# EAGLE design TinyBot (EAGLE 9.2.2)
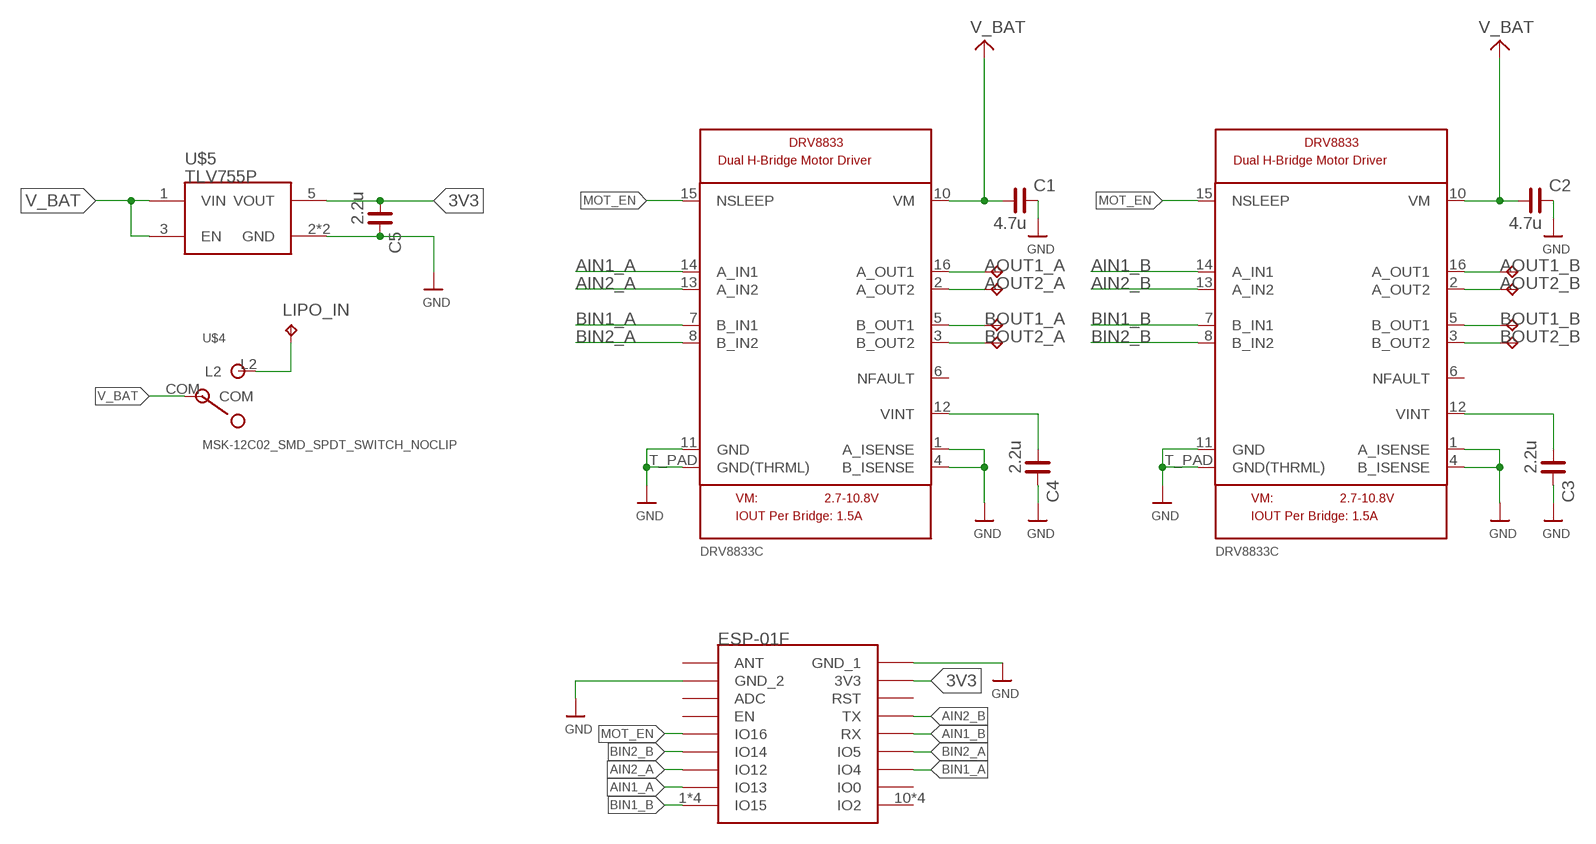
[diagram p0: schematic, sheet 1]

## Parts
C1  4.7u  C_0201  [C0201]
C2  4.7u  C_0201  [C0201]
C3  2.2u  C_0201  [C0201]
C4  2.2u  C_0201  [C0201]
C5  2.2u  C_0201  [C0201]
LIPO_IN  TPTP11SQ  [TP11SQ]
TP1  TPTP07SQ  [TP07SQ]
TP2  TPTP07SQ  [TP07SQ]
TP3  TPTP07SQ  [TP07SQ]
TP4  TPTP07SQ  [TP07SQ]
TP5  TPTP07SQ  [TP07SQ]
TP6  TPTP07SQ  [TP07SQ]
TP7  TPTP07SQ  [TP07SQ]
TP8  TPTP07SQ  [TP07SQ]
U$1  ESP01F  [ESP01F]
U$4  MSK-12C02_SMD_SPDT_SWITCH_NOCLIP  [MSK-12C02_NOCLIP]
U$5  TLV755P  [SOT23-5]
U$11  DRV8833C  [QFN16]
U$16  DRV8833C  [QFN16]

## Nets
3V3: C5.1 U$1.17(3V3) U$1.26(3V3) U$1.44(3V3) U$1.71(3V3) U$5.5(VOUT)
AIN1_A: U$1.2(IO13) U$1.29(IO13) U$1.47(IO13) U$1.56(IO13) U$11.14(A_IN1)
AIN1_B: U$1.14(RX) U$1.23(RX) U$1.41(RX) U$1.68(RX) U$16.14(A_IN1)
AIN2_A: U$1.3(IO12) U$1.30(IO12) U$1.48(IO12) U$1.57(IO12) U$11.13(A_IN2)
AIN2_B: U$1.15(TX) U$1.24(TX) U$1.42(TX) U$1.69(TX) U$16.13(A_IN2)
AOUT1_A: TP1.TP U$11.16(A_OUT1)
AOUT1_B: TP5.TP U$16.16(A_OUT1)
AOUT2_A: TP2.TP U$11.2(A_OUT2)
AOUT2_B: TP6.TP U$16.2(A_OUT2)
BIN1_A: U$1.12(IO4) U$1.21(IO4) U$1.39(IO4) U$1.66(IO4) U$11.7(B_IN1)
BIN1_B: U$1.1(IO15) U$1.28(IO15) U$1.46(IO15) U$1.55(IO15) U$16.7(B_IN1)
BIN2_A: U$1.13(IO5) U$1.22(IO5) U$1.40(IO5) U$1.67(IO5) U$11.8(B_IN2)
BIN2_B: U$1.4(IO14) U$1.31(IO14) U$1.49(IO14) U$1.58(IO14) U$16.8(B_IN2)
BOUT1_A: TP3.TP U$11.5(B_OUT1)
BOUT1_B: TP7.TP U$16.5(B_OUT1)
BOUT2_A: TP4.TP U$11.3(B_OUT2)
BOUT2_B: TP8.TP U$16.3(B_OUT2)
GND: C1.2 C2.2 C3.2 C4.2 C5.2 U$1.8(GND_2) U$1.18(GND_1) U$1.27(GND_1) U$1.35(GND_2) U$1.45(GND_1) U$1.53(GND_2) U$1.62(GND_2) U$1.72(GND_1) U$5.2(GND) U$5.4(GND) U$11.1(A_ISENSE) U$11.4(B_ISENSE) U$11.11(GND) U$11.T_PAD(GND(THRML)) U$16.1(A_ISENSE) U$16.4(B_ISENSE) U$16.11(GND) U$16.T_PAD(GND(THRML))
LIPO_IN: LIPO_IN.TP U$4.L2
MOT_EN: U$1.5(IO16) U$1.32(IO16) U$1.50(IO16) U$1.59(IO16) U$11.15(NSLEEP) U$16.15(NSLEEP)
V_BAT: C1.1 C2.1 U$4.COM U$5.1(VIN) U$5.3(EN) U$11.10(VM) U$16.10(VM) ; supply symbol labelled VMOTOR
VINT_A: C4.1 U$11.12(VINT)
VINT_B: C3.1 U$16.12(VINT)
Unconnected: U$1.6(EN) U$1.7(ADC) U$1.9(ANT) U$1.10(IO2) U$1.11(IO0) U$1.16(RST) U$1.19(IO2) U$1.20(IO0) U$1.25(RST) U$1.33(EN) U$1.34(ADC) U$1.36(ANT) U$1.37(IO2) U$1.38(IO0) U$1.43(RST) U$1.51(EN) U$1.52(ADC) U$1.54(ANT) U$1.60(EN) U$1.61(ADC) U$1.63(ANT) U$1.64(IO2) U$1.65(IO0) U$1.70(RST) U$11.6(NFAULT) U$16.6(NFAULT)

## Notes on the sheet
- V_BAT | V_BAT

## Library data of the parts
C1-C5 = rc-master-smd:C_: NON-POLARIZED CAP
LIPO_IN TP1-TP8 = testpad:TP: Test pad
U$1 = esp8266modules:ESP01F: ESP01F Module Based on the ESP8285. No Thermal Pad.
U$4 = MSK-12C02 Switch SPDT:MSK-12C02_SMD_SPDT_SWITCH_NOCLIP
U$5 = SparkFun-IC-Power:TLV755P
U$11 U$16 = qfn16:DRV8833C

## Board
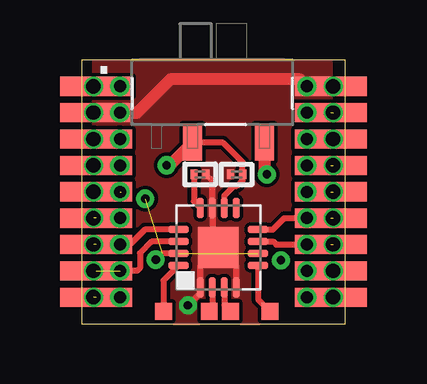
[diagram p1: board, top side]
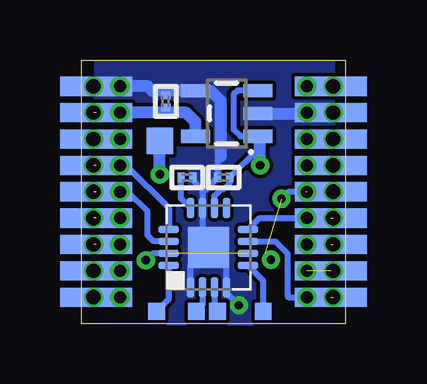
[diagram p2: board, bottom side, seen from below]

Size 11 x 11 mm. Coordinates in mm from the lower left corner, seen from the top.
Outline: 0,0 11,0 11,11 0,11 0,0
Copper layers (1*16): Top 0.035mm / dielectric 1.5mm / Bottom 0.035mm
Design rules "default *": minimum track width 6mil, minimum drill 0.35mm, track to track 6mil, track to pad 6mil, pad to pad 6mil, via to via 6mil, smd to smd 6mil, copper to edge 0mil, drill to drill 6mil, minimum pad ring 0mil, minimum via ring 8mil, stop-mask expansion 4mil, vias tented up to drill 0mil, thermal gap 10mil

### Footprints (pad centres in the part's own frame; a part is rotated, then mirrored left to right if it is on the bottom)
C0201 = smd 0.3 x 0.4: 1 -0.254,0; 2 0.254,0
TP11SQ = smd 1.1 x 1.1: TP 0,0
TP07SQ = smd 0.7 x 0.7: TP 0,0
ESP01F = smd 3 x 0.8: 1 0.1,1.1; 2 0.1,2.2; 3 0.1,3.3; 4 0.1,4.4; 5 0.1,5.5; 6 0.1,6.6; 7 0.1,7.7; 8 0.1,8.8; 9 0.1,9.9; 10 9.9,1.1; 11 9.9,2.2; 12 9.9,3.3; 13 9.9,4.4; 14 9.9,5.5; 15 9.9,6.6; 16 9.9,7.7; 17 9.9,8.8; 18 9.9,9.9 | smd 3 x 0.8 bottom: 19 9.9,1.1; 20 9.9,2.2; 21 9.9,3.3; 22 9.9,4.4; 23 9.9,5.5; 24 9.9,6.6; 25 9.9,7.7; 26 9.9,8.8; 27 9.9,9.9; 28 0.1,1.1; 29 0.1,2.2; 30 0.1,3.3; 31 0.1,4.4; 32 0.1,5.5; 33 0.1,6.6; 34 0.1,7.7; 35 0.1,8.8; 36 0.1,9.9 | drill 0.6 pad 0.8: 37 10,1.1; 38 10,2.2; 39 10,3.3; 40 10,4.4; 41 10,5.5; 42 10,6.6; 43 10,7.7; 44 10,8.8; 45 10,9.9; 46 0,1.1; 47 0,2.2; 48 0,3.3; 49 0,4.4; 50 0,5.5; 51 0,6.6; 52 0,7.7; 53 0,8.8; 54 0,9.9 | drill 0.5 pad 0.8: 55 1.1,1.1; 56 1.1,2.2; 57 1.1,3.3; 58 1.1,4.4; 59 1.1,5.5; 60 1.1,6.6; 61 1.1,7.7; 62 1.1,8.8; 63 1.1,9.9; 64 8.9,1.1; 65 8.9,2.2; 66 8.9,3.3; 67 8.9,4.4; 68 8.9,5.5; 69 8.9,6.6; 70 8.9,7.7; 71 8.9,8.8; 72 8.9,9.9
MSK-12C02_NOCLIP = smd 0.8 x 1.5: COM 0.823,2.1; L2 -2.177,2.1
SOT23-5 = smd 0.55 x 1.2: 1 -0.95,-1.3; 2 0,-1.3; 3 0.95,-1.3; 4 0.95,1.3; 5 -0.95,1.3
QFN16 = smd 0.85 x 0.3: 1 -1.655,0.75; 2 -1.655,0.25; 3 -1.655,-0.25; 4 -1.655,-0.75; 9 1.655,-0.75; 10 1.655,-0.25; 11 1.655,0.25; 12 1.655,0.75 | smd 0.3 x 0.85: 5 -0.75,-1.655; 6 -0.25,-1.655; 7 0.25,-1.655; 8 0.75,-1.655; 13 0.75,1.655; 14 0.25,1.655; 15 -0.25,1.655; 16 -0.75,1.655 | smd 1.7 x 1.7: T_PAD 0,0

### Placement (x,y rotation side)
C1  6.47,6.22 180 top
C2  5.07,6.1 180 bottom
C3  6.6,6.1 0 bottom
C4  4.95,6.22 0 top
C5  7.49,9.27 90 bottom
LIPO_IN  7.74,7.62 0 bottom
TP1  3.42,0.51 0 top
TP2  5.33,0.51 0 top
TP3  7.87,0.51 0 top
TP4  6.21,0.51 0 top
TP5  7.87,0.51 0 bottom
TP6  6.21,0.51 0 bottom
TP7  3.42,0.51 0 bottom
TP8  5.33,0.51 0 bottom
U$1  0.5,0 0 top
U$4  5.45,9.65 180 top
U$5  4.95,8.76 90 bottom
U$11  5.71,3.17 90 top
U$16  5.71,3.17 90 bottom

### Tracks (layer width: path | path; a pad name or v marks a point on that pad's centre or on a via)
3V3  (1 unrouted)
  Top 0.152: U$1.26 U$1.71
  Bottom 0.152: U$1.26 U$1.71
  Bottom 0.254: C5.1 7.49,8.8
  Bottom 0.508: U$5.5 6.25,8.41 6.63,8.8 7.49,8.8 U$1.71
AIN1_A  (1 unrouted)
  Top 0.254: U$11.14 2.93,3.42 2.43,2.93 2.43,2.31 2.32,2.2 U$1.56 | U$1.29 U$1.47
  Bottom 0.152: U$1.29 U$1.47
AIN1_B  (1 unrouted)
  Top 0.152: U$1.14 U$1.68
  Bottom 0.152: U$1.14 U$1.68
  Bottom 0.254: U$16.14 7.99,3.43 8.25,3.68 8.25,4.7 9.05,5.5 U$1.68
AIN2_A  (1 unrouted)
  Top 0.152: U$1.30 U$1.57
  Top 0.254: U$11.13 2.65,3.92 2.02,3.3 U$1.57
  Bottom 0.152: U$1.30 U$1.57
AIN2_B  (1 unrouted)
  Top 0.152: U$1.24 U$1.69
  Bottom 0.152: U$1.24 U$1.69
  Bottom 0.254: U$16.13 7.36,4.83 9.13,6.6 U$1.69
AOUT1_A
  Top 0.254: U$11.16 3.42,1.79 TP1.TP
AOUT1_B
  Bottom 0.254: U$16.16 7.36,1.01 TP5.TP
AOUT2_A
  Top 0.254: U$11.2 5.46,0.64 TP2.TP
AOUT2_B
  Bottom 0.254: U$16.2 5.96,0.77 TP6.TP
BIN1_A  (1 unrouted)
  Top 0.152: U$1.12 U$1.66
  Top 0.254: U$11.7 8,3.42 8.12,3.3 U$1.66
  Bottom 0.152: U$1.12 U$1.66
BIN1_B  (1 unrouted)
  Top 0.152: U$1.28 U$1.55
  Bottom 0.152: U$1.28 U$1.55
  Bottom 0.254: U$16.7 2.91,3.42 2.41,2.92 2.41,1.14 2.36,1.1 U$1.55
BIN2_A  (1 unrouted)
  Top 0.152: U$1.13 U$1.67
  Top 0.254: U$11.8 7.98,3.92 8.46,4.4 U$1.67
  Bottom 0.152: U$1.13 U$1.67
BIN2_B  (1 unrouted)
  Top 0.152: U$1.4 U$1.58
  Bottom 0.152: U$1.4 U$1.58
  Bottom 0.254: U$16.8 3.58,4.4 U$1.58
BOUT1_A
  Top 0.254: U$11.5 7.36,1.01 TP3.TP
BOUT1_B
  Bottom 0.254: U$16.5 3.42,1.79 TP7.TP
BOUT2_A
  Top 0.254: U$11.3 5.96,0.77 TP4.TP
BOUT2_B
  Bottom 0.254: U$16.3 5.46,0.64 TP8.TP
GND  (via drill 0.35)
  Top 0.254: U$16.T_PAD 4.96,2.42 U$16.4 4.96,1.28 v4.44,0.76 | U$16.1 6.46,2.42 U$16.T_PAD | U$16.T_PAD 5.46,3.42 U$11.11 5.46,5.96 C4.2
  Top 0.508: U$1.35 2.31,8.8 3.71,10.19 9.11,10.19 U$1.72
  Bottom 0.254: U$16.T_PAD 4.96,2.42 U$16.4 4.96,1.28 v4.44,0.76 | U$16.1 6.46,2.42 U$16.T_PAD | U$16.11 5.96,3.42 U$16.T_PAD | C3.2 6.34,5.97 5.96,5.58 U$16.11 | U$16.11 5.96,5.46 C2.2 5.33,6.86 5.2,6.99 | C5.2 7.49,9.71
  Bottom 0.508: U$1.72 8.24,9.9 8.05,9.71 7.49,9.71 U$5.4 5.61,9.71 5.2,9.3 5.2,6.99 | U$5.2 1.64,8.76 U$1.62
  pour Bottom (isolate 0.152, no thermals): 0.5,10.92 10.41,10.92 10.41,0 0.5,0
  pour Top (isolate 0.152, no thermals): 0.5,10.92 10.41,10.92 10.41,0 0.5,0
LIPO_IN  (via drill 0.35)
  Top 0.508: U$4.L2 7.63,6.33 v7.73,6.22
  Bottom 0.508: v7.73,6.22 LIPO_IN.TP
MOT_EN  (via drill 0.35)  (3 unrouted)
  Top 0.152: U$1.32 U$1.50
  Top 0.254: U$11.15 3.36,2.92 v3.1,2.67
  Bottom 0.152: 1.64,5.5 U$1.32 U$1.50
  Bottom 0.254: 1.64,5.5 2.37,5.5 v2.66,5.21 | U$16.15 8.04,2.92 v8.32,2.64
V_BAT  (via drill 0.35)
  Top 0.254: U$11.10 5.96,5.33 6.37,5.74 6.48,5.74 6.72,5.99 C1.1 6.72,6.73 5.9,7.55 U$4.COM
  Top 0.508: U$4.COM 3.68,6.6 v3.55,6.6
  Bottom 0.254: U$16.10 5.46,5.33 5.17,5.62 5.06,5.62 4.82,5.86 C2.1 3.65,7.27 U$5.1 4.38,7.81 4.65,8.09 4.65,9.56 4.5,9.71 U$5.3
  Bottom 0.508: v3.55,6.6 3.55,7.72 U$5.1
VINT_A
  Top 0.254: C4.1 4.69,5.1 U$11.12
VINT_B
  Bottom 0.254: U$16.12 6.85,5.22 C3.1